# Altium schematic sheet Main.SchDoc
size A4; Organization: Altium Limited; Address1: 3 Minna Close; Address2: Belrose; Address3: NSW 2085; Address4: Australia
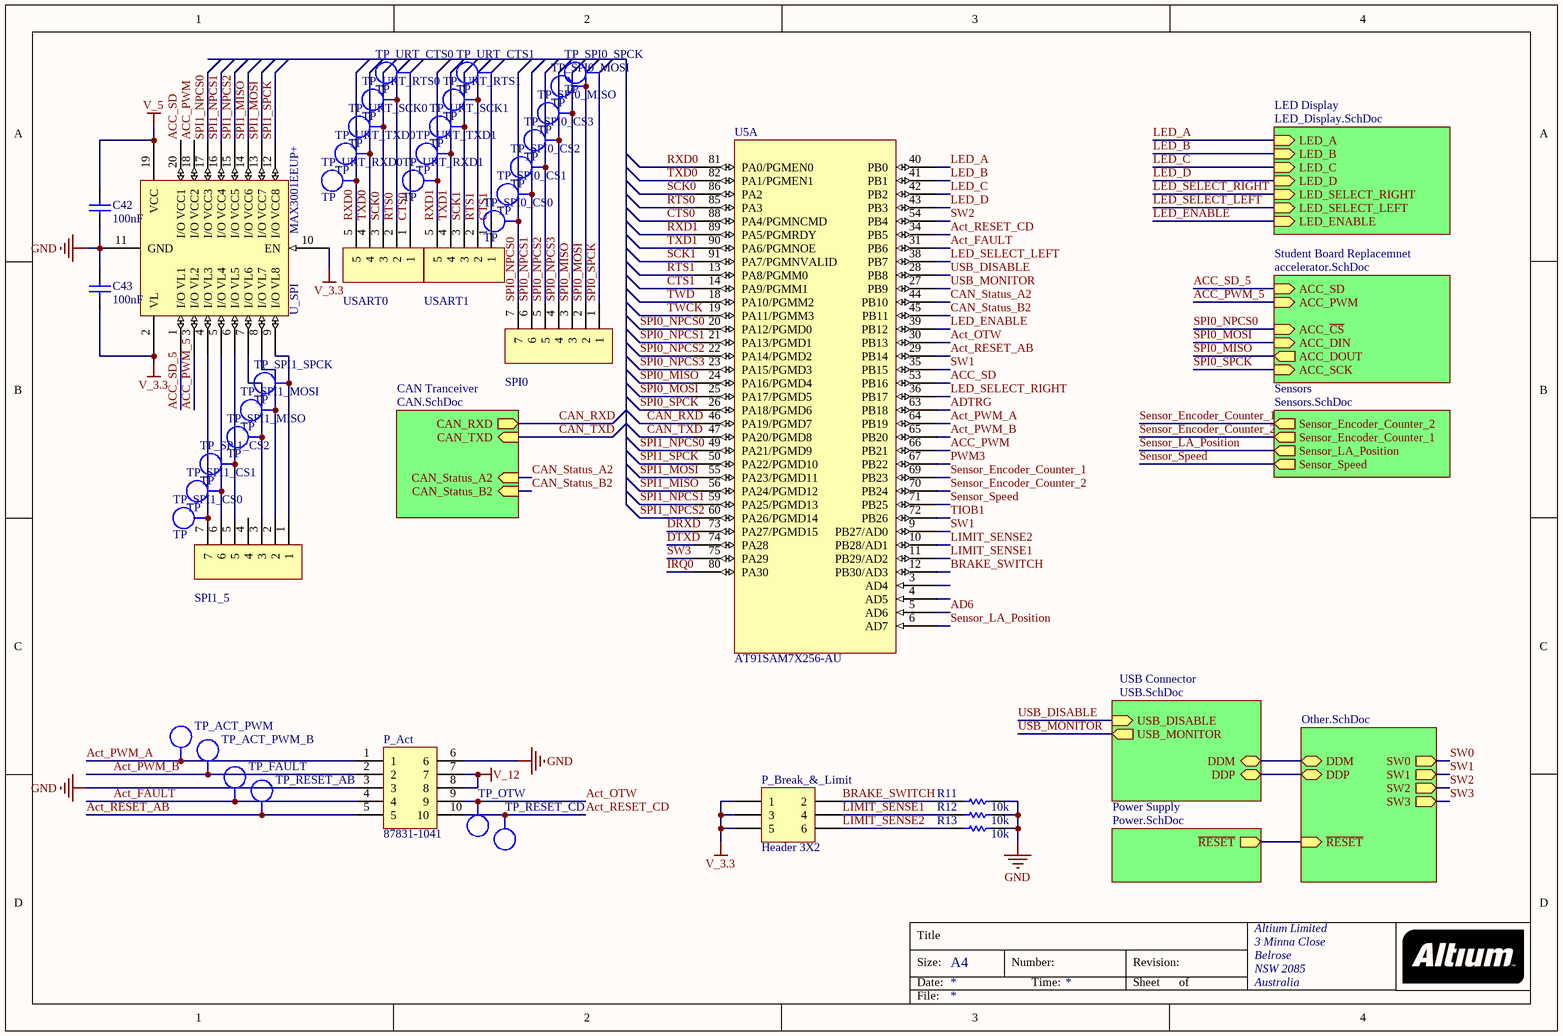
[diagram p0: Main.SchDoc]

## Parts
C42  100nF  [0603]
C43  100nF  [0603]
P_Act  87831-1041  [87831-1041]
P_Break_&_Limit  Header 3X2  [HDR2X3]
R11  10k  [0603]
R12  10k  [0603]
R13  10k  [0603]
SPI0  53261-0771  [53261-0771]  (value not drawn)
SPI1_5  53261-0771  [53261-0771]  (value not drawn)
TP_ACT_PWM  TP  [TEST_POINT_4X2MM]  (value not drawn)  (no BOM)
TP_ACT_PWM_B  TP  [TEST_POINT_4X2MM]  (value not drawn)  (no BOM)
TP_FAULT  TP  [TEST_POINT_4X2MM]  (value not drawn)  (no BOM)
TP_OTW  TP  [TEST_POINT_4X2MM]  (value not drawn)  (no BOM)
TP_RESET_AB  TP  [TEST_POINT_4X2MM]  (value not drawn)  (no BOM)
TP_RESET_CD  TP  [TEST_POINT_4X2MM]  (value not drawn)  (no BOM)
TP_SPI0_CS0  TP  [TEST_POINT_4X2MM]  (no BOM)
TP_SPI0_CS1  TP  [TEST_POINT_4X2MM]  (no BOM)
TP_SPI0_CS2  TP  [TEST_POINT_4X2MM]  (no BOM)
TP_SPI0_CS3  TP  [TEST_POINT_4X2MM]  (no BOM)
TP_SPI0_MISO  TP  [TEST_POINT_4X2MM]  (no BOM)
TP_SPI0_MOSI  TP  [TEST_POINT_4X2MM]  (no BOM)
TP_SPI0_SPCK  TP  [TEST_POINT_4X2MM]  (no BOM)
TP_SPI1_CS0  TP  [TEST_POINT_4X2MM]  (no BOM)
TP_SPI1_CS1  TP  [TEST_POINT_4X2MM]  (no BOM)
TP_SPI1_CS2  TP  [TEST_POINT_4X2MM]  (no BOM)
TP_SPI1_MISO  TP  [TEST_POINT_4X2MM]  (no BOM)
TP_SPI1_MOSI  TP  [TEST_POINT_4X2MM]  (no BOM)
TP_SPI1_SPCK  TP  [TEST_POINT_4X2MM]  (no BOM)
TP_URT_CTS0  TP  [TEST_POINT_4X2MM]  (no BOM)
TP_URT_CTS1  TP  [TEST_POINT_4X2MM]  (no BOM)
TP_URT_RTS0  TP  [TEST_POINT_4X2MM]  (no BOM)
TP_URT_RTS1  TP  [TEST_POINT_4X2MM]  (no BOM)
TP_URT_RXD0  TP  [TEST_POINT_4X2MM]  (no BOM)
TP_URT_RXD1  TP  [TEST_POINT_4X2MM]  (no BOM)
TP_URT_SCK0  TP  [TEST_POINT_4X2MM]  (no BOM)
TP_URT_SCK1  TP  [TEST_POINT_4X2MM]  (no BOM)
TP_URT_TXD0  TP  [TEST_POINT_4X2MM]  (no BOM)
TP_URT_TXD1  TP  [TEST_POINT_4X2MM]  (no BOM)
U5  AT91SAM7X256-AU  [LQFP100_N]  (part A of 4)
U_SPI  MAX3001EEUP+  [TSOP65P640X110-20N]
USART0  53261-0571  [53261-0571]  (value not drawn)
USART1  53261-0571  [53261-0571]  (value not drawn)

## Sub-sheets
CAN Tranceiver = CAN.SchDoc: CAN_TXD (in), CAN_RXD (out), CAN_Status_A2 (in), CAN_Status_B2 (in)
LED Display = LED_Display.SchDoc: LED_ENABLE (in), LED_A (in), LED_B (in), LED_C (in), LED_D (in), LED_SELECT_LEFT (in), LED_SELECT_RIGHT (in)
Power Supply = Power.SchDoc: ~{RESET} (out)
Sensors = Sensors.SchDoc: Sensor_Speed (out), Sensor_LA_Position (out), Sensor_Encoder_Counter_2 (out), Sensor_Encoder_Counter_1 (out)
Student Board Replacemnet = accelerator.SchDoc: ACC_PWM (in), ACC_SD (in), ACC_~{CS} (in), ACC_DIN (in), ACC_DOUT (out), ACC_SCK (in)
USB Connector = USB.SchDoc: USB_DISABLE (in), USB_MONITOR (out), DDM (bidir), DDP (bidir)
? = Other.SchDoc: DDM (bidir), DDP (bidir), ~{RESET} (in), SW2 (out), SW3 (out), SW0 (out), SW1 (out)

## Nets
GND: C42.1 C43.2 P_Act.3 P_Act.6 R11.2 R12.2 R13.2 U_SPI.11(GND)
V_3.3: C43.1 P_Break_&_Limit.1 P_Break_&_Limit.3 P_Break_&_Limit.5 U_SPI.2(VL) U_SPI.10(EN)
V_5: C42.2 U_SPI.19(VCC)
V_12: P_Act.7 P_Act.8
ACC_PWM: U5.66(PB21) U_SPI.18(I/O_VCC2)
ACC_PWM_5: U_SPI.3(I/O_VL2) ; sheet Student Board Replacemnet/ACC_PWM
ACC_SD: U5.53(PB16) U_SPI.20(I/O_VCC1)
ACC_SD_5: U_SPI.1(I/O_VL1) ; sheet Student Board Replacemnet/ACC_SD
Act_FAULT: P_Act.4 TP_FAULT.1 U5.31(PB6)
Act_OTW: P_Act.9 TP_OTW.1 U5.30(PB13)
Act_PWM_A: P_Act.1 TP_ACT_PWM.1 U5.64(PB19)
Act_PWM_B: P_Act.2 TP_ACT_PWM_B.1 U5.65(PB20)
Act_RESET_AB: P_Act.5 TP_RESET_AB.1 U5.29(PB14)
Act_RESET_CD: P_Act.10 TP_RESET_CD.1 U5.34(PB5)
AD6: U5.5(AD6)
ADTRG: U5.63(PB18)
BRAKE_SWITCH: P_Break_&_Limit.2 R11.1 U5.12(PB30/AD3)
CAN_RXD: U5.46(PA19/PGMD7) ; sheet CAN Tranceiver/CAN_RXD
CAN_Status_A2: U5.44(PB10) ; sheet CAN Tranceiver/CAN_Status_A2
CAN_Status_B2: U5.45(PB11) ; sheet CAN Tranceiver/CAN_Status_B2
CAN_TXD: U5.47(PA20/PGMD8) ; sheet CAN Tranceiver/CAN_TXD
CTS0: TP_URT_CTS0.1 U5.88(PA4/PGMNCMD) USART0.1
CTS1: TP_URT_CTS1.1 U5.14(PA9/PGMM1) USART1.1
DRXD: U5.73(PA27/PGMD15)
DTXD: U5.74(PA28)
IRQ0: U5.80(PA30)
LED_A: U5.40(PB0) ; sheet LED Display/LED_A
LED_B: U5.41(PB1) ; sheet LED Display/LED_B
LED_C: U5.42(PB2) ; sheet LED Display/LED_C
LED_D: U5.43(PB3) ; sheet LED Display/LED_D
LED_ENABLE: U5.39(PB12) ; sheet LED Display/LED_ENABLE
LED_SELECT_LEFT: U5.38(PB7) ; sheet LED Display/LED_SELECT_LEFT
LED_SELECT_RIGHT: U5.36(PB17) ; sheet LED Display/LED_SELECT_RIGHT
LIMIT_SENSE1: P_Break_&_Limit.4 R12.1 U5.11(PB29/AD2)
LIMIT_SENSE2: P_Break_&_Limit.6 R13.1 U5.10(PB28/AD1)
PWM3: U5.67(PB22)
RTS0: TP_URT_RTS0.1 U5.85(PA3) USART0.2
RTS1: TP_URT_RTS1.1 U5.13(PA8/PGMM0) USART1.2
RXD0: TP_URT_RXD0.1 U5.81(PA0/PGMEN0) USART0.5
RXD1: TP_URT_RXD1.1 U5.89(PA5/PGMRDY) USART1.5
SCK0: TP_URT_SCK0.1 U5.86(PA2) USART0.3
SCK1: TP_URT_SCK1.1 U5.91(PA7/PGMNVALID) USART1.3
Sensor_Encoder_Counter_1: U5.69(PB23) ; sheet Sensors/Sensor_Encoder_Counter_2
Sensor_Encoder_Counter_2: U5.70(PB24) ; sheet Sensors/Sensor_Encoder_Counter_1
Sensor_LA_Position: U5.6(AD7) ; sheet Sensors/Sensor_LA_Position
Sensor_Speed: U5.71(PB25) ; sheet Sensors/Sensor_Speed
SPI0_MISO: SPI0.3 TP_SPI0_MISO.1 U5.24(PA16/PGMD4) ; sheet Student Board Replacemnet/ACC_DOUT
SPI0_MOSI: SPI0.2 TP_SPI0_MOSI.1 U5.25(PA17/PGMD5) ; sheet Student Board Replacemnet/ACC_DIN
SPI0_NPCS0: SPI0.7 TP_SPI0_CS0.1 U5.20(PA12/PGMD0) ; sheet Student Board Replacemnet/ACC_~{CS}
SPI0_NPCS1: SPI0.6 TP_SPI0_CS1.1 U5.21(PA13/PGMD1)
SPI0_NPCS2: SPI0.5 TP_SPI0_CS2.1 U5.22(PA14/PGMD2)
SPI0_NPCS3: SPI0.4 TP_SPI0_CS3.1 U5.23(PA15/PGMD3)
SPI0_SPCK: SPI0.1 TP_SPI0_SPCK.1 U5.26(PA18/PGMD6) ; sheet Student Board Replacemnet/ACC_SCK
SPI1_MISO: U5.56(PA24/PGMD12) U_SPI.14(I/O_VCC6)
SPI1_MOSI: U5.55(PA23/PGMD11) U_SPI.13(I/O_VCC7)
SPI1_NPCS0: U5.49(PA21/PGMD9) U_SPI.17(I/O_VCC3)
SPI1_NPCS1: U5.59(PA25/PGMD13) U_SPI.16(I/O_VCC4)
SPI1_NPCS2: U5.60(PA26/PGMD14) U_SPI.15(I/O_VCC5)
SPI1_SPCK: U5.50(PA22/PGMD10) U_SPI.12(I/O_VCC8)
SW0: sheet /SW0
SW1: U5.9(PB27/AD0) U5.35(PB15) ; sheet /SW1
SW2: U5.54(PB4) ; sheet /SW2
SW3: U5.75(PA29) ; sheet /SW3
TIOB1: U5.72(PB26)
TWCK: U5.19(PA11/PGMM3)
TWD: U5.18(PA10/PGMM2)
TXD0: TP_URT_TXD0.1 U5.82(PA1/PGMEN1) USART0.4
TXD1: TP_URT_TXD1.1 U5.90(PA6/PGMNOE) USART1.4
USB_DISABLE: U5.28(PB8) ; sheet USB Connector/USB_DISABLE
USB_MONITOR: U5.27(PB9) ; sheet USB Connector/USB_MONITOR
NetSPI1_5_1: SPI1_5.1 TP_SPI1_SPCK.1 U_SPI.9(I/O_VL8)
NetSPI1_5_2: SPI1_5.2 TP_SPI1_MOSI.1 U_SPI.8(I/O_VL7)
NetSPI1_5_3: SPI1_5.3 TP_SPI1_MISO.1 U_SPI.7(I/O_VL6)
NetSPI1_5_5: SPI1_5.5 TP_SPI1_CS2.1 U_SPI.6(I/O_VL5)
NetSPI1_5_6: SPI1_5.6 TP_SPI1_CS1.1 U_SPI.5(I/O_VL4)
NetSPI1_5_7: SPI1_5.7 TP_SPI1_CS0.1 U_SPI.4(I/O_VL3)
(unnamed): sheet /DDM, sheet USB Connector/DDM
(unnamed): sheet /DDP, sheet USB Connector/DDP
(unnamed): sheet /~{RESET}, sheet Power Supply/~{RESET}

Not connected (* = marked no-connect by the designer): SPI1_5 4; U5 3(AD4) 4(AD5)

## Notes on the sheet
- Title
- Size:
- Date:
- A4
- Number:
- Time:
- Revision:
- Sheet
- of
- File:

## Library data of the parts
C42 C43 = CP_100nF 0603: CAP CER .10UF 50V X5R 0603; Manufacturer: Taiyo Yuden; Manufacturer PN: UMK107B7104KA-T; LatestRevisionDate: 29 May 08; Supplier 1: Digi-Key; Supplier Part Number 1: 478-6206-1-ND; Value: 100nF; Part Number: CP_100nF 0603; Component Kind: Standard; Component Type: Standard; Designator: CP_100nF 0603; Pin Count: 2; Signal Integrity: Cap; Simulation: CAP
P_Act = 87831-1041: HEADER MALE 10POS VERT W/LOCK; Manufacturer: Molex; Manufacturer PN: 87831-1041; Supplier 1: Digi-Key; Supplier Part Number 1: WM3591-ND
P_Break_&_Limit = Header 3X2: Header, 3-Pin, Dual row; LatestRevisionDate: 17-Jul-2002; LatestRevisionNote: Re-released for DXP Platform.; Publisher: Altium Limited
R11-R13 = RS_10k 0603: RES 10.0K OHM 1/10W 1% 0603 SMD; Manufacturer: Yageo; Manufacturer PN: RC0603FR-0710KL; LatestRevisionDate: 29 May 08; Supplier 1: Digi-Key; Supplier Part Number 1: 311-10.0KHRTR-ND; Value: 10k; Part Number: RS_10k 0603; Component Kind: Standard; Component Type: Standard; Designator: RS_10k 0603; Pin Count: 2; Signal Integrity: Res; Simulation: RESISTOR
SPI0 SPI1_5 = 53261-0771: 7-pin PicoBlade Right-angle Header; Manufacturer: Molex; Manufacturer Part Number: 53261-0771
  SPI0: Supplier: Digikey; Supplier Part Number: WM7625CT-ND
  SPI1_5: Supplier 1: Digikey; Supplier Part Number 1: WM7625CT-ND
TP_ACT_PWM TP_ACT_PWM_B TP_FAULT TP_OTW TP_RESET_AB TP_RESET_CD TP_SPI0_CS0-TP_SPI0_CS3 TP_SPI0_MISO TP_SPI0_MOSI TP_SPI0_SPCK TP_SPI1_CS0-TP_SPI1_CS2 TP_SPI1_MISO TP_SPI1_MOSI TP_SPI1_SPCK TP_URT_CTS0 TP_URT_CTS1 TP_URT_RTS0 TP_URT_RTS1 TP_URT_RXD0 TP_URT_RXD1 TP_URT_SCK0 TP_URT_SCK1 TP_URT_TXD0 TP_URT_TXD1 = TP_TESTPOINT: Test-Point; LatestRevisionDate: 29 May 08; Manufacturer PN: *; Manufacturer: *; Supplier 1: Digi-Key; Supplier Part Number 1: 5016KTR-ND; Value: TP; Part Number: TP_TESTPOINT; Component Type: Standard (No BOM); Designator: TP_TESTPOINT; Pin Count: 1
U5 = AT91SAM7X256-AU: ARM7TDMI 32-Bit RISC CPU 256KB Flash and 64KB SRAM; Manafacture Part Number: AT91SAM7XC256B-AU; Manafacture: Atmel; Published: 16-Oct-2006; DatasheetVersion: 17-Oct-2005; PackageVersion: Apr-2006; PackageReference: LQFP100; Publisher: Altium Limited; PackageDescription: 100-Pin Thin Quad Flat Pack 0.5 mm Pitch; Code_JEDEC: MS-026-BED; ComponentLink1Description: Manufacturer Link; ComponentLink1URL: http://www.atmel.com; ComponentLink2Description: Datasheet; ComponentLink2URL: http://www.atmel.com/dyn/resources/prod_documents/6120s.pdf; Supplier 1: Digi-Key; Supplier Part Number 1: AT91SAM7XC256B-AU-ND
U_SPI = MAX3001EEUP+: Manufacture: MAXIM INTEGRATED PRODUCTS; Supplier Part Number 1: 1379763; Supplier 1: Element 14; Manufacture PN: MAX3001EEUP+
USART0 USART1 = 53261-0571: 5-pin PicoBlade Right-angle Header; Manufacturer: Molex; Manufacturer Part Number: 53261-0571
  USART0: Supplier: Digikey; Supplier Part Number: WM7623CT-ND
  USART1: Supplier 1: Digikey; Supplier Part Number 1: WM7623CT-ND